# Altium project CAR_Interface.PrjPcb
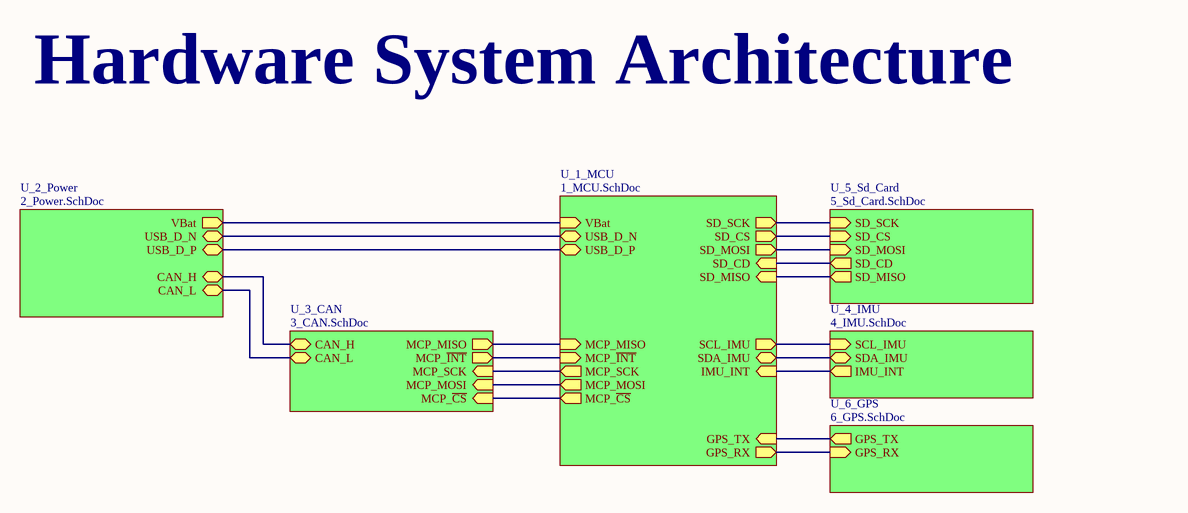
[diagram p0: 0_Overview.SchDoc]
6 sheets, 65 parts. Net scope: hierarchical (ports join the sheet entries above them; power ports are global).
Board file: CAR_Interface_PCB.PcbDoc
Sheets:
  0_Overview.SchDoc
    U_1_MCU = 1_MCU.SchDoc
    U_2_Power = 2_Power.SchDoc
    U_4_IMU = 4_IMU.SchDoc
    U_5_Sd_Card = 5_Sd_Card.SchDoc
    U_6_GPS = 6_GPS.SchDoc

## Sheet 0_Overview.SchDoc
size A4; SheetNumber: 1; SheetTotal: 7

### Sub-sheets
U_1_MCU = 1_MCU.SchDoc: USB_D_N (bidir), USB_D_P (bidir), MCP_SCK (out), MCP_MOSI (out), MCP_MISO (in), MCP_~{INT} (in), MCP_~{CS} (out), SD_SCK (out), SD_CS (out), SD_MOSI (out), SD_MISO (in), GPS_TX (in), GPS_RX (out), SCL_IMU (out), SDA_IMU (bidir), IMU_INT (in), VBat (in), SD_CD (in)
U_2_Power = 2_Power.SchDoc: CAN_L (bidir), CAN_H (bidir), USB_D_P (bidir), USB_D_N (bidir), VBat (out)
U_3_CAN = 3_CAN.SchDoc (file not in this document): CAN_H (bidir), CAN_L (bidir), MCP_SCK (in), MCP_MOSI (in), MCP_MISO (out), MCP_~{INT} (out), MCP_~{CS} (in)
U_4_IMU = 4_IMU.SchDoc: SCL_IMU (in), SDA_IMU (bidir), IMU_INT (out)
U_5_Sd_Card = 5_Sd_Card.SchDoc: SD_SCK (in), SD_CS (in), SD_MOSI (in), SD_MISO (out), SD_CD (out)
U_6_GPS = 6_GPS.SchDoc: GPS_TX (out), GPS_RX (in)

### Nets
CAN_H: sheet U_2_Power/CAN_H, sheet U_3_CAN/CAN_H
CAN_L: sheet U_2_Power/CAN_L, sheet U_3_CAN/CAN_L
GPS_RX: sheet U_1_MCU/GPS_RX, sheet U_6_GPS/GPS_RX
GPS_TX: sheet U_1_MCU/GPS_TX, sheet U_6_GPS/GPS_TX
IMU_INT: sheet U_1_MCU/IMU_INT, sheet U_4_IMU/IMU_INT
SCL_IMU: sheet U_1_MCU/SCL_IMU, sheet U_4_IMU/SCL_IMU
SD_CD: sheet U_1_MCU/SD_CD, sheet U_5_Sd_Card/SD_CD
SD_CS: sheet U_1_MCU/SD_CS, sheet U_5_Sd_Card/SD_CS
SD_MISO: sheet U_1_MCU/SD_MISO, sheet U_5_Sd_Card/SD_MISO
SD_MOSI: sheet U_1_MCU/SD_MOSI, sheet U_5_Sd_Card/SD_MOSI
SD_SCK: sheet U_1_MCU/SD_SCK, sheet U_5_Sd_Card/SD_SCK
SDA_IMU: sheet U_1_MCU/SDA_IMU, sheet U_4_IMU/SDA_IMU
USB_D_N: sheet U_1_MCU/USB_D_N, sheet U_2_Power/USB_D_N
USB_D_P: sheet U_1_MCU/USB_D_P, sheet U_2_Power/USB_D_P
VBat: sheet U_1_MCU/VBat, sheet U_2_Power/VBat
NetU100_18: sheet U_1_MCU/MCP_~{CS}, sheet U_3_CAN/MCP_~{CS}
NetU100_19: sheet U_1_MCU/MCP_MOSI, sheet U_3_CAN/MCP_MOSI
NetU100_20: sheet U_1_MCU/MCP_SCK, sheet U_3_CAN/MCP_SCK
NetU100_21: sheet U_1_MCU/MCP_MISO, sheet U_3_CAN/MCP_MISO
NetU100_22: sheet U_1_MCU/MCP_~{INT}, sheet U_3_CAN/MCP_~{INT}

### Notes on the sheet
- Hardware System Architecture

## Sheet 1_MCU.SchDoc
size A4; SheetNumber: 2; SheetTotal: 7
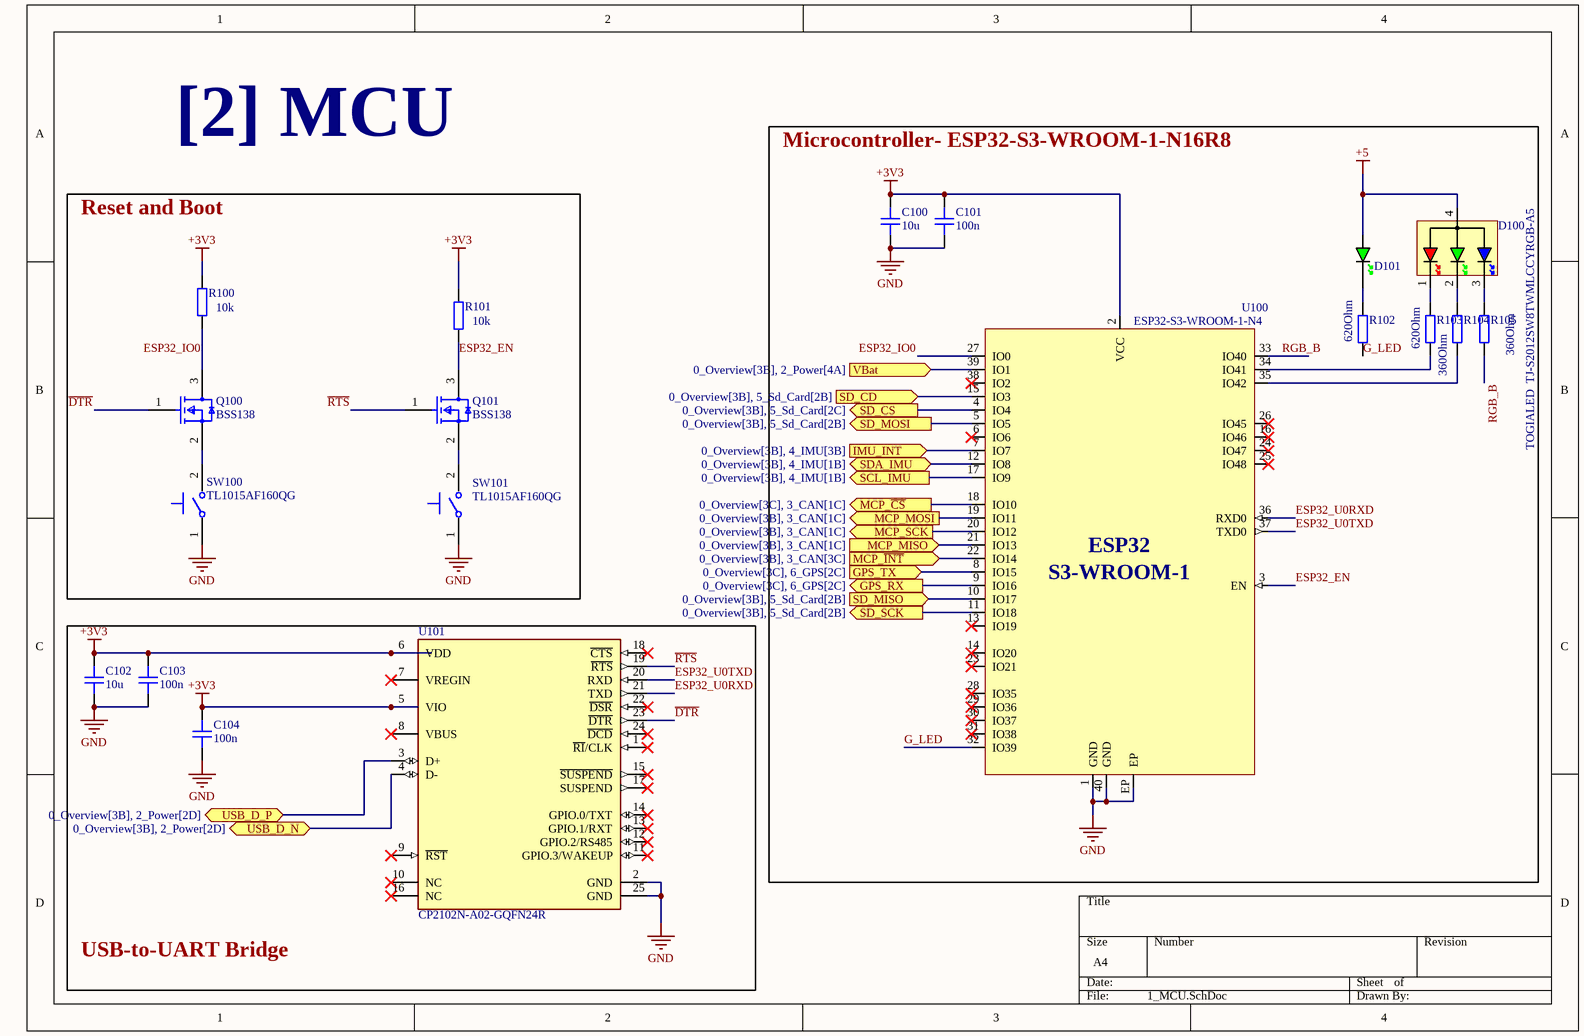
[diagram p1: 1_MCU.SchDoc]

### Parts
C100  10u  [CAP_0805]
C101  100n  [CAP_0603]
C102  10u  [CAP_0805]
C103  100n  [CAP_0603]
C104  100n  [CAP_0603]
D100  TOGIALED  TJ-S2012SW8TWMLCCYRGB-A5  [150080M153000]
D101  GREEN  [LED_0603_GREEN]  (value not drawn)
Q100  BSS138  [FP-318-08-IPC_B]
Q101  BSS138  [FP-318-08-IPC_B]
R100  10k  [RES_0603]
R101  10k  [RES_0603]
R102  620Ohm  [RES_0603]
R103  620Ohm  [RES_0603]
R104  360Ohm  [RES_0603]
R105  360Ohm  [RES_0603]
SW100  TL1015AF160QG  [FP-TL1015AF160QG-MFG]
SW101  TL1015AF160QG  [FP-TL1015AF160QG-MFG]
U100  ESP32-S3-WROOM-1-N4  [ESP32-S3-WROOM-1]
U101  CP2102N-A02-GQFN24R  [FP-CP2102N-A02-GQFN24R-MFG]

### Blocks framed on the sheet
Microcontroller- ESP32‑S3‑WROOM‑1‑N16R8: C100 C101 D100 D101 R102-R105 U100
Reset and Boot: Q100 Q101 R100 R101 SW100 SW101
USB‑to‑UART Bridge: C102-C104 U101

### Ports
GPS_RX (out, see 0_Overview[3C], 6_GPS[2C]), GPS_TX (in, see 0_Overview[3C], 6_GPS[2C]), IMU_INT (in, see 0_Overview[3B], 4_IMU[3B]), MCP_MISO (in, see 0_Overview[3B], 3_CAN[1C]), MCP_MOSI (out, see 0_Overview[3B], 3_CAN[1C]), MCP_SCK (out, see 0_Overview[3B], 3_CAN[1C]), MCP_~{CS} (out, see 0_Overview[3C], 3_CAN[1C]), MCP_~{INT} (in, see 0_Overview[3B], 3_CAN[3C]), SCL_IMU (out, see 0_Overview[3B], 4_IMU[1B]), SD_CD (in, see 0_Overview[3B], 5_Sd_Card[2B]), SD_CS (out, see 0_Overview[3B], 5_Sd_Card[2C]), SD_MISO (in, see 0_Overview[3B], 5_Sd_Card[2B]), SD_MOSI (out, see 0_Overview[3B], 5_Sd_Card[2B]), SD_SCK (out, see 0_Overview[3B], 5_Sd_Card[2B]), SDA_IMU (bidir, see 0_Overview[3B], 4_IMU[1B]), USB_D_N (bidir, see 0_Overview[3B], 2_Power[2D]), USB_D_P (bidir, see 0_Overview[3B], 2_Power[2D]), VBat (in, see 0_Overview[3B], 2_Power[4A])

### Nets
+3V3: C100.2 C101.1 C102.2 C103.1 C104.1 R100.2 R101.2 U100.2(VCC) U101.5(VIO) U101.6(VDD)
+5: D100.4(AC) D101.A
GND: C100.1 C101.2 C102.1 C103.2 C104.2 SW100.1 SW101.1 U100.1(GND) U100.40(GND) U100.EP U101.2(GND) U101.25(GND)
~{DTR}: Q100.1(G) U101.23(~{DTR})
ESP32_EN: Q101.3(D) R101.1 U100.3(EN)
ESP32_IO0: Q100.3(D) R100.1 U100.27(IO0)
ESP32_U0RXD: U100.36(RXD0) U101.21(TXD)
ESP32_U0TXD: U100.37(TXD0) U101.20(RXD)
G_LED: R102.1 U100.32(IO39)
GPS_RX: U100.9(IO16) ; port GPS_RX
GPS_TX: U100.8(IO15) ; port GPS_TX
IMU_INT: U100.7(IO7) ; port IMU_INT
~{RTS}: Q101.1(G) U101.19(~{RTS})
RGB_B: R105.1 U100.33(IO40)
SCL_IMU: U100.17(IO9) ; port SCL_IMU
SD_CD: U100.15(IO3) ; port SD_CD
SD_CS: U100.4(IO4) ; port SD_CS
SD_MISO: U100.10(IO17) ; port SD_MISO
SD_MOSI: U100.5(IO5) ; port SD_MOSI
SD_SCK: U100.11(IO18) ; port SD_SCK
SDA_IMU: U100.12(IO8) ; port SDA_IMU
USB_D_N: U101.4(D-) ; port USB_D_N
USB_D_P: U101.3(D+) ; port USB_D_P
VBat: U100.39(IO1) ; port VBat
NetD100_1: D100.1(CR) R103.2
NetD100_2: D100.2(CG) R104.2
NetD100_3: D100.3(CB) R105.2
NetD101_K: D101.K R102.2
NetQ100_2: Q100.2(S) SW100.2
NetQ101_2: Q101.2(S) SW101.2
NetR103_1: R103.1 U100.34(IO41)
NetR104_1: R104.1 U100.35(IO42)
NetU100_18: U100.18(IO10) ; port MCP_~{CS}
NetU100_19: U100.19(IO11) ; port MCP_MOSI
NetU100_20: U100.20(IO12) ; port MCP_SCK
NetU100_21: U100.21(IO13) ; port MCP_MISO
NetU100_22: U100.22(IO14) ; port MCP_~{INT}

Not connected (* = marked no-connect by the designer): U100 6(IO6)* 13(IO19)* 14(IO20)* 16(IO46)* 23(IO21)* 24(IO47)* 25(IO48)* 26(IO45)* 28(IO35)* 29(IO36)* 30(IO37)* 31(IO38)* 38(IO2)*; U101 1(~{RI}/CLK)* 7(VREGIN)* 8(VBUS)* 9(~{RST})* 10(NC)* 11(GPIO.3/WAKEUP)* 12(GPIO.2/RS485)* 13(GPIO.1/RXT)* 14(GPIO.0/TXT)* 15(~{SUSPEND})* 16(NC)* 17(SUSPEND)* 18(~{CTS})* 22(~{DSR})* 24(~{DCD})*

### Notes on the sheet
- [2] MCU
- (in symbol ESP32-S3-WROOM-1-N4) ESP32; S3-WROOM-1

### Library data of the parts
C100 C102 = CAP_0805: Capacitor SMD 0805; Manufacturer: *; Manufacturer Part Number: *; Distributor Link: *; LCSC: *; Rating: *; Dielectric: *
C101 C103 C104 = CAP_0603: Capacitor SMD 0603; Manufacturer: *; Manufacturer Part Number: *; Distributor Link: *; LCSC: *; Rating: *; Dielectric: *
D100 = 150080M153000: RGB LED Common Anode SMD Diffused 0805 Top View; Manufacturer: Wurth; Manufacturer Part Number: 150080M153000; Distributor Link: https://www.mouser.de/ProductDetail/Wurth-Elektronik/150080M153000?qs=5aG0NVq1C4wI5cZ2wabu5A%3D%3D
D101 = LED_0603_GREEN: LED 0603 GREEN SMD
Q100 Q101 = CMP-07173-000101-1: MOSFET N-CH 50V 220MA SOT-23; Turn-Off Delay Time: 20ns; Element Configuration: Single; Rds On Max: 3.5R; Gate to Source Voltage (Vgs): 20V; Threshold Voltage: 1.3V; Number of Elements: 1; Power Dissipation: 360mW; Rise Time: 9ns; Turn-On Delay Time: 2.5ns; Input Capacitance: 27pF; On-State Resistance: 6R; Lead Free: Lead Free; Length: 2.92mm; Width: 1.3mm; Drain to Source Breakdown Voltage: 50V; Min Operating Temperature: -55°C; REACH SVHC: No SVHC; Packaging: Tape and Reel; Radiation Hardening: No; Height: 0.93mm; Drain to Source Voltage (Vdss): 50V; Current Rating: 220mA; Voltage Rating (DC): 50V; Weight: 0.03g; Continuous Drain Current (ID): 220mA; Number of Pins: 3; Nominal Vgs: 1.3V; Max Power Dissipation: 360mW; Fall Time: 9ns; Drain to Source Resistance: 3.5R; Contact Plating: Tin; Case/Package: SOT-23; Package Quantity: 1; Dual Supply Voltage: 50V; Mount: Surface Mount; Termination: SMD/SMT; Max Operating Temperature: 150°C
R100-R105 = RES_0603: Resistor SMD 0603; Manufacturer: *; Manufacturer Part Number: *; Distributor Link: *; LCSC: *
SW100 SW101 = CMP-17879-000003-1: SWITCH TACTILE SPST-NO 0.05A 12V; Actuator Type: Standard; Actuator Length: 0.5mm; Contact Current Rating: 50mA; Mechanical Life: 200000Cycles; Switch Function: Off-Mom; Switch Travel: 0.2mm; Illumination Type: Non-Illuminated; Operating Force: 160gf; Actuator Material: Nylon; Electrical Life: 50000Cycles; Throw Configuration: SPST; Contact Resistance: 100mR; Orientation: Straight; Max Voltage Rating (DC): 12V; Max Operating Temperature: 70°C; Package Quantity: 1; Contact Material: Silver; Packaging: Tape and Reel; Mount: Surface Mount; Color: Beige; Termination: Gull Wing; Case/Package: SMD/SMT; Voltage Rating (DC): 12V; Contact Plating: Silver; REACH SVHC: No SVHC; Min Operating Temperature: -20°C; Current Rating: 50mA; Lead Free: Lead Free
U100 = ESP32-S3-WROOM-1-N4: 2.4 GHz Wi-Fi (802.11 b/g/n) and Bluetooth 5 (LE) Module ESP32-S3, 4MB Flash, on-board PCB antenna); Manufacturer: Espressif; Manufacturer Part Number: ESP32-S3-WROOM-1-N4; Distributor Link: https://www.mouser.de/ProductDetail/Espressif-Systems/ESP32-S3-WROOM-1-N4?qs=Li%252BoUPsLEnsO%2FkiJOUK0FQ%3D%3D
U101 = CMP-08107-000009-2: IC USB TO UART BRIDGE QFN24; Manufacturer Lifecycle Status: FULL PRODUCTION; NexarPartId: 99772192; Max Junction Temperature (Tj): 105°C; Min Supply Voltage: 1.71V; Max Supply Voltage: 3.6V; Number of Digital IO: 4; Interface: I2C, RS-485, UART, USB; Lifecycle Status: Production; Min Operating Temperature: -40°C; Height: 800µm; Ambient Temperature Range High: 85°C; Schedule B: 8542390000, 8542390000; Max Operating Temperature: 85°C

## Sheet 2_Power.SchDoc
size A4; SheetNumber: 4; SheetTotal: 7
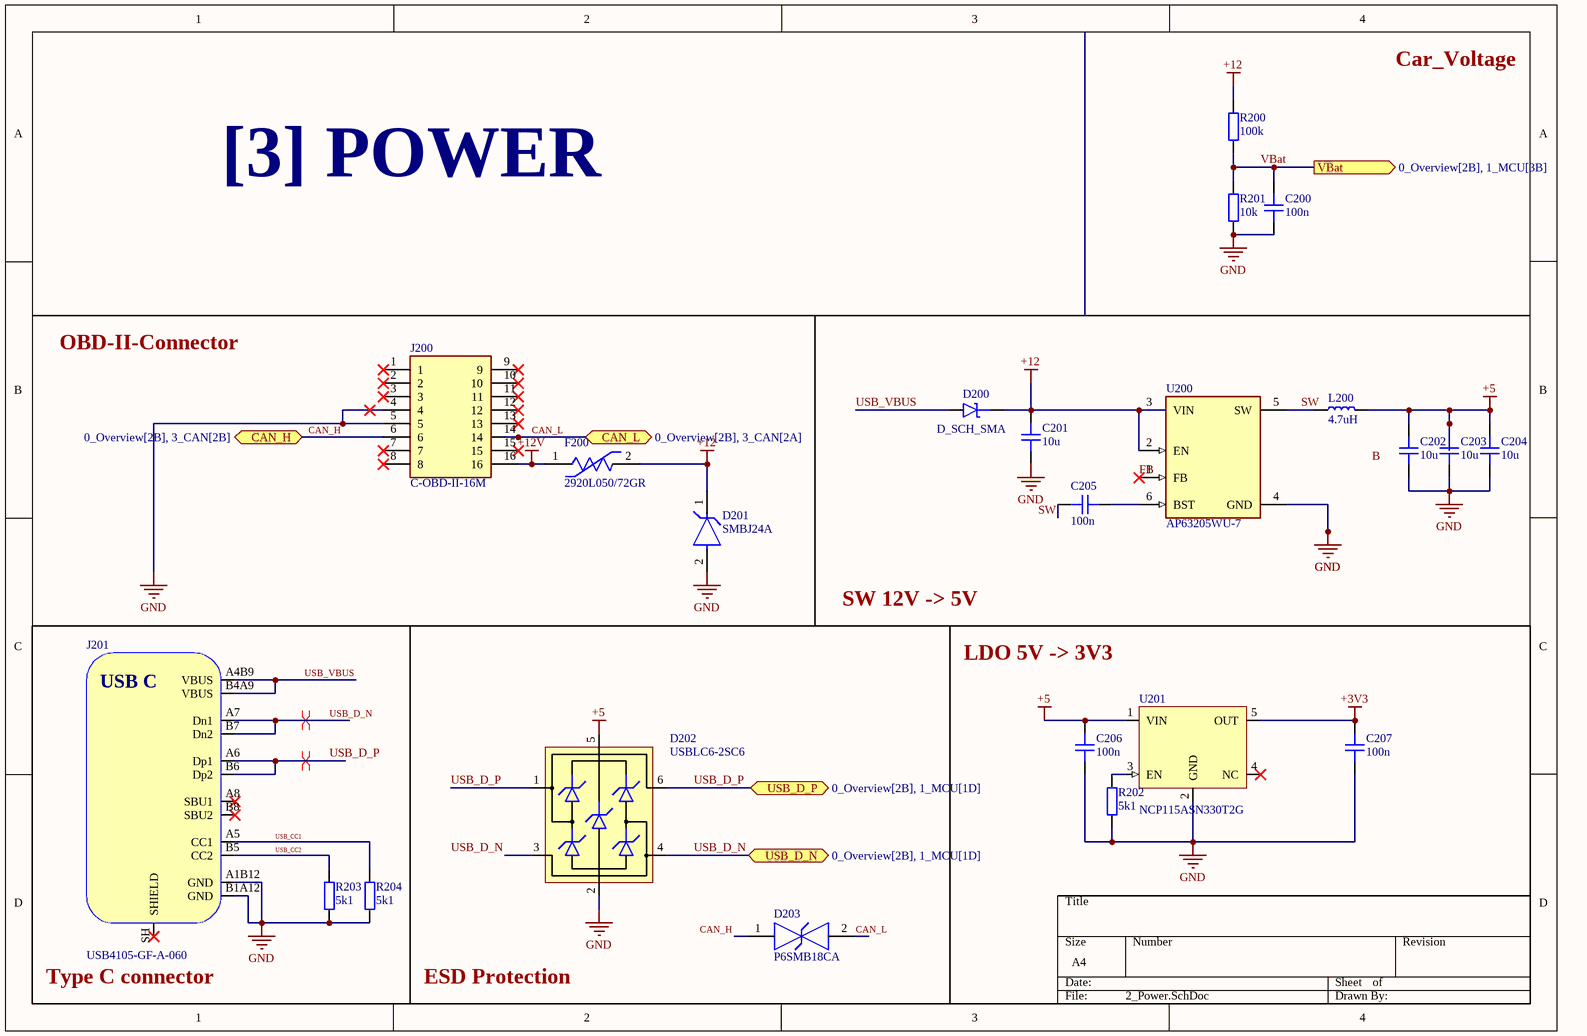
[diagram p2: 2_Power.SchDoc]

### Parts
C200  100n  [CAP_0805]
C201  10u  [CAP_0805]
C202  10u  [CAP_0805]
C203  10u  [CAP_0805]
C204  10u  [CAP_0805]
C205  100n  [CAP_0603]
C206  100n  [CAP_0603]
C207  100n  [CAP_0603]
D200  D_SCH_SMA  [DO-214AC-2 (SMA)]
D201  SMBJ24A  [FP-SMBJ-MFG]
D202  USBLC6-2SC6  [SOT-23-6]
D203  P6SMB18CA  [FP-P6SMB-CA-MFG]
F200  2920L050/72GR  [FP-2920L-MFG]
J200  C-OBD-II-16M  [COMTECH_C-OBD-II-16M]
J201  USB4105-GF-A-060  [USB4105-GF-A-060]
L200  4.7uH  [ASPI-4030S]
R200  100k  [RES_0805]
R201  10k  [RES_0805]
R202  5k1  [RES_0603]
R203  5k1  [RES_0603]
R204  5k1  [RES_0603]
U200  AP63205WU-7  [FP-TSOT26-MFG]
U201  NCP115ASN330T2G  [TSOT25]

### Ports
CAN_H (bidir, see 0_Overview[2B], 3_CAN[2B]), CAN_L (bidir, see 0_Overview[2B], 3_CAN[2A]), USB_D_N (bidir, see 0_Overview[2B], 1_MCU[1D]), USB_D_P (bidir, see 0_Overview[2B], 1_MCU[1D]), VBat (out, see 0_Overview[2B], 1_MCU[3B])

### Nets
+3V3: C207.1 U201.5(OUT)
+5: C202.2 C203.2 C204.2 C206.1 D202.5(VBUS) L200.2 U201.1(VIN)
+12: C201.2 D200.K D201.1(C) F200.2 R200.2 U200.2(EN) U200.3(VIN)
+12V: F200.1 J200.16
GND: C200.1 C201.1 C202.1 C203.1 C204.1 C206.2 C207.2 D201.2(A) D202.2(GND) J200.4 J200.5 J201.A1B12(GND) J201.B1A12(GND) R201.1 R202.1 R203.1 R204.1 U200.4(GND) U201.2(GND)
CAN_H: D203.1 J200.6 ; port CAN_H
CAN_L: D203.2 J200.14 ; port CAN_L
FB: U200.1(FB)
SW: C205.2 L200.1 U200.5(SW)
USB_CC1: J201.A5(CC1) R204.2
USB_CC2: J201.B5(CC2) R203.2
USB_D_N: D202.3(IO2) D202.4(IO2) J201.A7(Dn1) J201.B7(Dn2) ; port USB_D_N
USB_D_P: D202.1(IO1) D202.6(IO1) J201.A6(Dp1) J201.B6(Dp2) ; port USB_D_P
USB_VBUS: D200.A J201.A4B9(VBUS) J201.B4A9(VBUS)
VBat: C200.2 R200.1 R201.2 ; port VBat
NetC205_1: C205.1 U200.6(BST)
NetR202_2: R202.2 U201.3(EN)

Not connected (* = marked no-connect by the designer): J200 1* 2* 3* 7* 8* 9* 10* 11* 12* 13* 15*; J201 A8(SBU1)* B8(SBU2)* SH(SHIELD)*; U201 4(NC)*

### Layout directives
differential pair; differential pair class USB_D: USB_D_N, USB_D_P

### Notes on the sheet
- Car_Voltage
- [3] POWER
- OBD-II-Connector
- SW 12V -> 5V
- LDO 5V -> 3V3
- (near J201) Type C connector
- ESD Protection
- Labels drawn without touching a wire or pin: B
- (in symbol USB4105-GF-A-060) USB C

### Library data of the parts
C200-C204 = CAP_0805: Capacitor SMD 0805; Manufacturer: *; Manufacturer Part Number: *; Distributor Link: *; LCSC: *; Rating: *; Dielectric: *
C205-C207 = CAP_0603: Capacitor SMD 0603; Manufacturer: *; Manufacturer Part Number: *; Distributor Link: *; LCSC: *; Rating: *; Dielectric: *
D200 = D_SCHOTTKY_SMA: Diode Schottky SMD SMA (DO-214AA)
D201 = CMP-07401-000035-1: TVS DIODE 24V 38.9V SMB; Max Breakdown Voltage: 30.7V; Operating Supply Voltage: 3.5V; Min Breakdown Voltage: 26.7V; Test Current: 1mA; Direction: Unidirectional; Peak Pulse Current: 15.4A; Peak Pulse Power: 600W; Number of Unidirectional Channels: 1; Element Configuration: Single; Power Line Protection: No; Diode Type: ZENER; Leakage Current: 5uA; Max Surge Current: 100A; ESD Protection: Yes; Width: 3.94mm; Number of Pins: 2; Clamping Voltage: 38.9V; Reverse Standoff Voltage: 24V; Breakdown Voltage: 30.7V; RoHS Compliant: Yes; Package Quantity: 1; Case/Package: SMB; Mount: Surface Mount; Resistor Type: Zener; Packaging: Tape and Reel; Reverse Breakdown Voltage: 26.7V; Series: SMBJ; Radiation Hardening: No; Max Operating Temperature: 150°C; Termination: SMD/SMT; Number of Channels: 1; Length: 4.57mm; REACH SVHC: No SVHC; Number of Elements: 1; Polarity: Unidirectional; Height: 2.42mm; Max Power Dissipation: 600W; Max Reverse Leakage Current: 5uA; Min Operating Temperature: -55°C
D202 = USBLC6-2SC6: Low-Capacitance ESD Protection USB; Manufacturer: STMicroelectronics; Manufacturer Part Number: USBLC6-2SC6; Distributor Link: https://www.mouser.de/ProductDetail/STMicroelectronics/USBLC6-2SC6?qs=po45yt2pPpu%2FhNIlwQdTlg%3D%3D
D203 = CMP-08607-000095-1: TVS DIODE 15.3V 25.5V DO214AA; Min Breakdown Voltage: 17.1V; Peak Pulse Current: 24.2A; Power Line Protection: No; Max Surge Current: 24A; Polarity: Bidirectional; Power Dissipation: 600W; Number of Bidirectional Channels: 1; Max Breakdown Voltage: 18.9V; Test Current: 1mA; Max Power Dissipation: 5W; Leakage Current: 1uA; Operating Supply Voltage: 15.3V; Min Operating Temperature: -55°C; Mount: Surface Mount; Package Quantity: 3000; Lead Free: Lead Free; Reverse Standoff Voltage: 15.3V; Breakdown Voltage: 17.1V; Composition: Zener; Max Operating Temperature: 150°C; Number of Channels: 1; Termination: SMD/SMT; Case/Package: SMB; Packaging: Tape and Reel; Reverse Breakdown Voltage: 17.1V; Peak Pulse Power: 600W; Number of Elements: 1; Clamping Voltage: 25.5V; Direction: Bidirectional; Number of Pins: 2
F200 = CMP-08606-000028-1: PTC RESET FUSE 60V 1.1A 2920; Manufacturer Part Number: 2920L110/60MR; Manufacturer: Littelfuse; Value: 0.12-0.41Ω; Trip Time: 0.5s; Current Rating: 20A; Trip Current: 2.2A; Category: Fuse; Temperature: -40°C to +85°C; ComponentLink2Description: Datasheet; Lead Free: Yes; Temperature Range Low: -40°C; ComponentLink2URL: https://m.littelfuse.com/~/media/electronics/datasheets/resettable_ptcs/littelfuse_ptc_2920l_datasheet.pdf.pdf; Height: 2mm; Temperature Range High: +85°C; Automotive: No; Digikey Description: PTC RESET FUSE 60V 1.1A 2920; Device Class L3: unset; RoHS: TRUE; Device Class L2: PTC Resettable Fuses; Voltage Rating: 60V; Octopart: https://octopart.com/2920l110%2F60mr-littelfuse-75250824; Device Class L1: Circuit Protection; Package: 2920L; Hold Current: 1.1A; Ambient Temperature Range High: +85°C; Resistance: 0.12-0.41Ω; Ambient Temperature Range Low: -40°C
J200 = CMP-002-00074-1: OBD II 16pin 90 Degree Angle Male Plug Connector; MF: Comtech Electronic Co., LTD; Value: *; Design Item ID: C-OBD-II-16M; Case/Package: None; Check_prices: https://www.snapeda.com/parts/C-OBD-II-16M/Comtech+Electronic+Co.%252C+LTD/view-part/?ref=eda; Component Type: Standard; Source: C-OBD-II-16M.SchLib; Pins: 16; SnapEDA_Link: https://www.snapeda.com/parts/C-OBD-II-16M/Comtech+Electronic+Co.%252C+LTD/view-part/?ref=snap; MP: C-OBD-II-16M
J201 = USB4105-GF-A-060: USB Connector Type C SMT 12 Pin; Manufacturer: GCT; Manufacturer Part Number: USB4105-GF-A-060; Distributor Link: https://eu.mouser.com/ProductDetail/GCT/USB4105-GF-A-060?qs=QNEnbhJQKvY2mocwNJzgfA%3D%3D
L200 = ASPI-4030S: Power Inductor SMD ASPI-4030S Series; Manufacturer: ABRACON; Manufacturer Part Number: ASPI-4030S*; Distirbutor Link: *
R200 R201 = RES_0805: Resistor SMD 0805; Manufacturer: *; Manufacturer Part Number: *; Distributor Link: *; LCSC: *
R202-R204 = RES_0603: Resistor SMD 0603; Manufacturer: *; Manufacturer Part Number: *; Distributor Link: *; LCSC: *
U200 = CMP-12757-000001-1: IC REG BUCK 5V 2A TSOT26; Manufacturer: Diodes Inc.; Max Junction Temp: +160°C; Max Duty Cycle: 100%; Standoff Height: 0.01mm; Max Supply Voltage: 32V; Number Of Outputs: 1; Min Supply Voltage: 3.8V; Output Type: Fixed; Switching Frequency: 1100kHz; Nominal Supply Current: 22uA; Automotive: No; RoHS: TRUE; Switching Topology: Buck; Temperature: -40°C to +85°C; Footprint Url: https://www.diodes.com/assets/Package-Files/TSOT26.pdf; Lead Free: Yes; Digikey Description: IC REG BUCK 5V 2A TSOT26; Device Class L3: Voltage Regulators - Switching; Ambient Temperature Range High: +85°C; Category: IC; Package: TSOT26; Output Voltage: 5V; Output Current: 2A; ComponentLink2Description: Datasheet; Device Class L2: Power Management ICs; Ambient Temperature Range Low: -40°C; Temperature Range High: +85°C; Temperature Range Low: -40°C; Octopart: https://octopart.com/ap63205wu-7-diodes+inc.-98099551; Manufacturer Part Number: AP63205WU-7; Height: 1mm; Device Class L1: Integrated Circuits (ICs); ComponentLink2URL: https://www.diodes.com/assets/Datasheets/AP63200-AP63201-AP63203-AP63205.pdf
U201 = NCP115ASN330T2G: LDO Regulator - High PSRR 300 mA 3.3V TSOP-5; Manufacturer: ON Semiconductor; Manufacturer Part Number: NCP115ASN330T2G

## Sheet 4_IMU.SchDoc
size A4; SheetNumber: 6; SheetTotal: 7
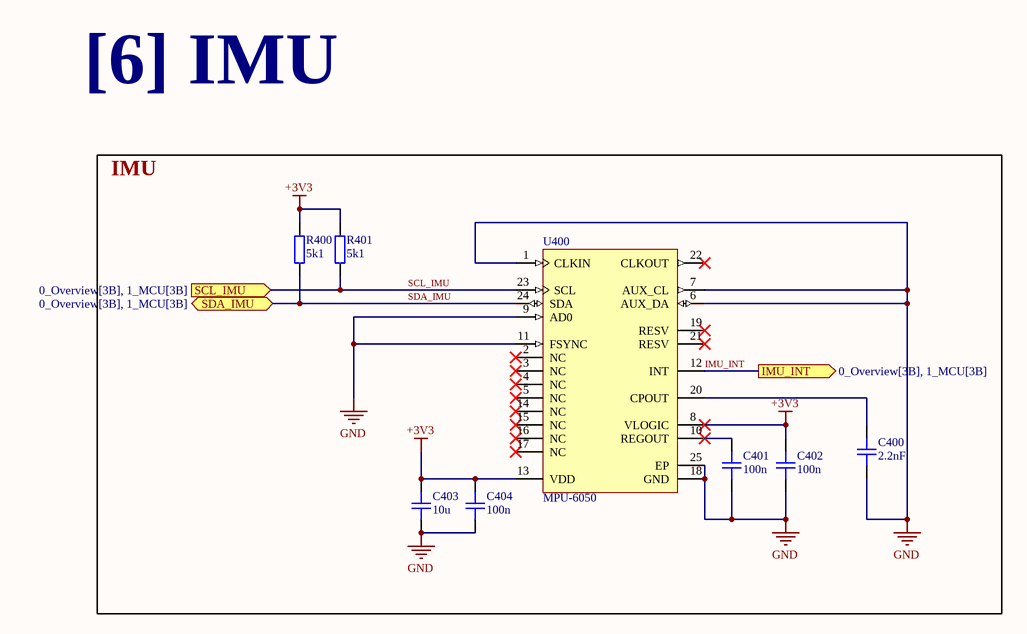
[diagram p3: 4_IMU.SchDoc]

### Parts
C400  2.2nF  [CAP_0603]
C401  100n  [CAP_0603]
C402  100n  [CAP_0603]
C403  10u  [CAP_0805]
C404  100n  [CAP_0603]
R400  5k1  [RES_0603]
R401  5k1  [RES_0603]
U400  MPU-6050  [IS-QFN-24_V]

### Blocks framed on the sheet
IMU: C400-C404 R400 R401 U400

### Ports
IMU_INT (out, see 0_Overview[3B], 1_MCU[3B]), SCL_IMU (in, see 0_Overview[3B], 1_MCU[3B]), SDA_IMU (bidir, see 0_Overview[3B], 1_MCU[3B])

### Nets
+3V3: C402.1 C403.2 C404.1 R400.2 R401.2 U400.8(VLOGIC) U400.13(VDD)
GND: C400.2 C401.2 C402.2 C403.1 C404.2 U400.1(CLKIN) U400.6(AUX_DA) U400.7(AUX_CL) U400.9(AD0) U400.11(FSYNC) U400.18(GND) U400.25(EP)
IMU_INT: U400.12(INT) ; port IMU_INT
SCL_IMU: R401.1 U400.23(SCL) ; port SCL_IMU
SDA_IMU: R400.1 U400.24(SDA) ; port SDA_IMU
NetC400_1: C400.1 U400.20(CPOUT)
NetC401_1: C401.1 U400.10(REGOUT)

Not connected (* = marked no-connect by the designer): U400 2(NC)* 3(NC)* 4(NC)* 5(NC)* 14(NC)* 15(NC)* 16(NC)* 17(NC)* 19(RESV)* 21(RESV)* 22(CLKOUT)*

### Notes on the sheet
- [6] IMU

### Library data of the parts
C400-C402 C404 = CAP_0603: Capacitor SMD 0603; Manufacturer: *; Manufacturer Part Number: *; Distributor Link: *; LCSC: *; Rating: *; Dielectric: *
C403 = CAP_0805: Capacitor SMD 0805; Manufacturer: *; Manufacturer Part Number: *; Distributor Link: *; LCSC: *; Rating: *; Dielectric: *
R400 R401 = RES_0603: Resistor SMD 0603; Manufacturer: *; Manufacturer Part Number: *; Distributor Link: *; LCSC: *
U400 = CMP-1753-00002-2: 3-Axis Gyroscope, Accelerometer and a Digital Motion Processor(TM) (DMP), 2.375 to 3.46 V, -40 to 85 degC, 24-Pin QFN, RoHS, Tape and Reel; Manufacturer: InvenSense; Featured Product: MPU-60506-Axis,IntegratedI²CSolution; Other Names: 1428-1007-2 / MPU6050; Sensor Type: MotionTracking; Online Catalog: MPU-6000™Series; Unit PriceUSD: Digital; Datasheet Version: Rev. 3.3, 05/2012; Category: Sensors,Transducers; Datasheet URL: http://datasheet.octopart.com/MPU-6050-InvenSense-datasheet-14421344.pdf; Family: Multifunction; Standard Package: 5,000; Manufacturer URL: http://www.invensense.com/; Output Type: Digital; Dynamic Catalog: MPU-6000™Series

## Sheet 5_Sd_Card.SchDoc
size A4; SheetNumber: 6; SheetTotal: 7
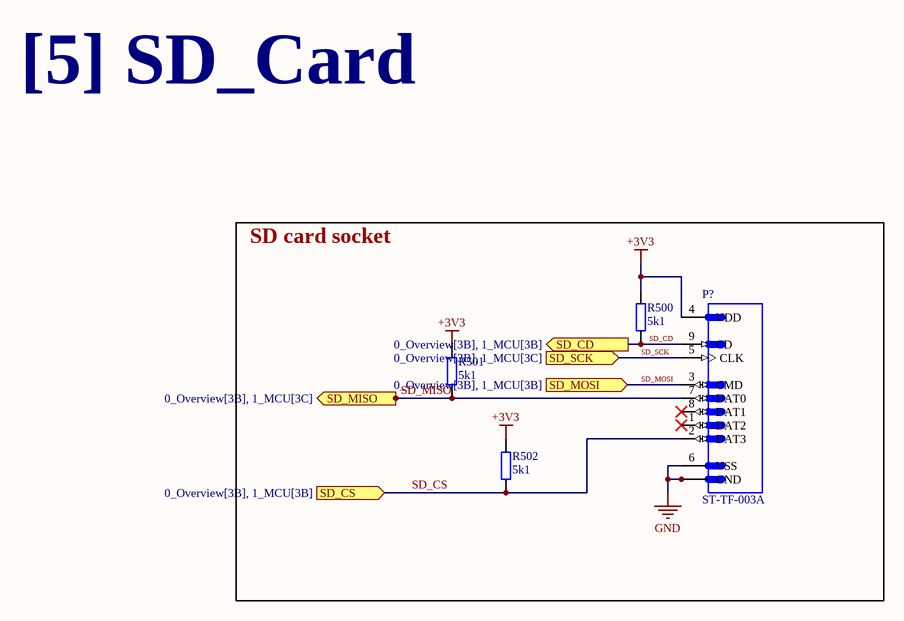
[diagram p4: 5_Sd_Card.SchDoc]

### Parts
P?  ST-TF-003A  [SUNTECH_ST-TF-003A]
R500  5k1  [RES_0603]
R501  5k1  [RES_0603]
R502  5k1  [RES_0603]

### Blocks framed on the sheet
SD card socket: P? R500-R502

### Ports
SD_CD (out, see 0_Overview[3B], 1_MCU[3B]), SD_CS (in, see 0_Overview[3B], 1_MCU[3B]), SD_MISO (out, see 0_Overview[3B], 1_MCU[3C]), SD_MOSI (in, see 0_Overview[3B], 1_MCU[3B]), SD_SCK (in, see 0_Overview[3B], 1_MCU[3C])

### Nets
+3V3: P?.4(VDD) R500.2 R501.2 R502.2
GND: P?.6(VSS) P?.G1(GND) P?.G2(GND) P?.G3(GND) P?.G4(GND)
SD_CD: P?.9(CD) R500.1 ; port SD_CD
SD_CS: P?.2(DAT3) R502.1 ; port SD_CS
SD_MISO: P?.7(DAT0) R501.1 ; port SD_MISO
SD_MOSI: P?.3(CMD) ; port SD_MOSI
SD_SCK: P?.5(CLK) ; port SD_SCK

Not connected (* = marked no-connect by the designer): P? 1(DAT2)* 8(DAT1)*

### Notes on the sheet
- [5] SD_Card

### Library data of the parts
P? = CMP-002-00072-2: Micro SD Card Socket; Case/Package: None; Source: ST-TF-003A.SchLib; Component Type: Standard; Availability: Unavailable; MP: ST-TF-003A; Value: *; Price: None; Design Item ID: ST-TF-003A; Pins: 13
R500-R502 = RES_0603: Resistor SMD 0603; Manufacturer: *; Manufacturer Part Number: *; Distributor Link: *; LCSC: *

## Sheet 6_GPS.SchDoc
size A4; SheetNumber: 3; SheetTotal: 7
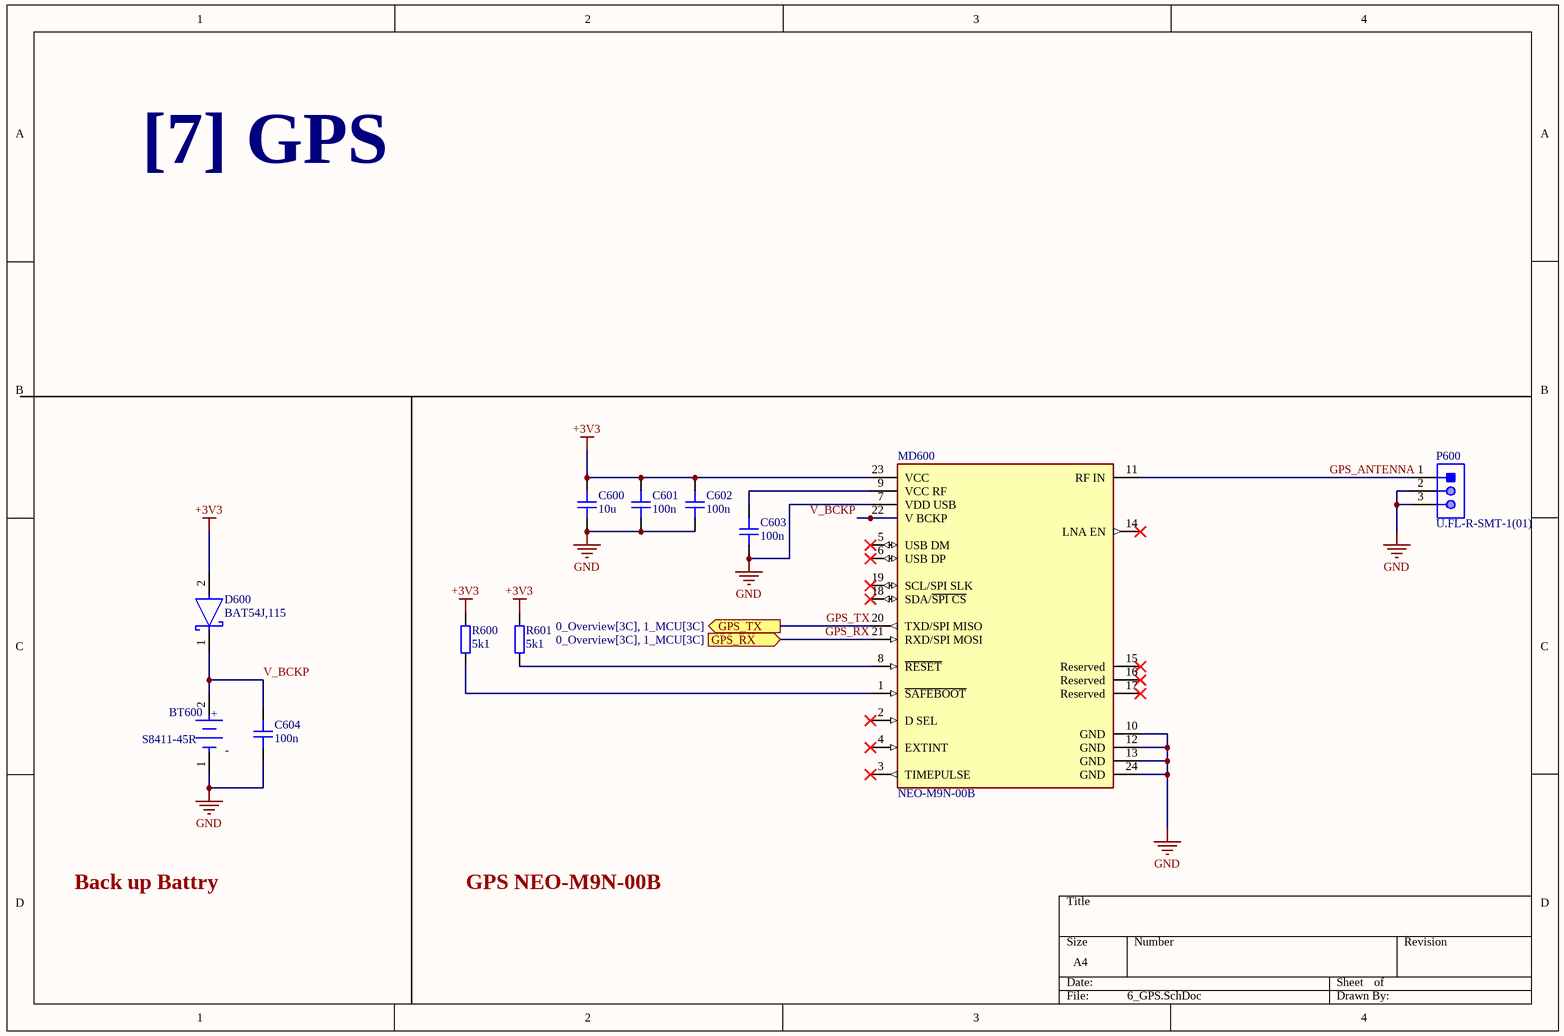
[diagram p5: 6_GPS.SchDoc]

### Parts
BT600  S8411-45R  [FP-S8411-45R-MFG]
C600  10u  [CAP_0805]
C601  100n  [CAP_0603]
C602  100n  [CAP_0603]
C603  100n  [CAP_0603]
C604  100n  [CAP_0603]
D600  BAT54J,115  [FP-SOD323F-MFG]
MD600  NEO-M9N-00B  [FP-NEO-M9N-00B-MFG]
P600  U.FL-R-SMT-1(01)  [HRS-U.FL-R-SMT-3_V]
R600  5k1  [RES_0603]
R601  5k1  [RES_0603]

### Ports
GPS_RX (in, see 0_Overview[3C], 1_MCU[3C]), GPS_TX (out, see 0_Overview[3C], 1_MCU[3C])

### Nets
+3V3: C600.2 C601.1 C602.1 D600.2(A) MD600.23(VCC) R600.2 R601.2
GND: BT600.1(C) C600.1 C601.2 C602.2 C603.2 C604.2 MD600.7(VDD_USB) MD600.10(GND) MD600.12(GND) MD600.13(GND) MD600.24(GND) P600.2 P600.3
GPS_ANTENNA: MD600.11(RF_IN) P600.1
GPS_RX: MD600.21(RXD/SPI_MOSI) ; port GPS_RX
GPS_TX: MD600.20(TXD/SPI_MISO) ; port GPS_TX
V_BCKP: BT600.2(A) C604.1 D600.1(C) MD600.22(V_BCKP)
NetC603_1: C603.1 MD600.9(VCC_RF)
NetMD600_1: MD600.1(~{SAFEBOOT}) R600.1
NetMD600_8: MD600.8(~{RESET}) R601.1

Not connected (* = marked no-connect by the designer): MD600 2(D_SEL)* 3(TIMEPULSE)* 4(EXTINT)* 5(USB_DM)* 6(USB_DP)* 14(LNA_EN)* 15(Reserved)* 16(Reserved)* 17(Reserved)* 18(SDA/~{SPI_CS})* 19(SCL/SPI_SLK)*

### Notes on the sheet
- [7] GPS
- Back up Battry
- GPS NEO-M9N-00B
- (in symbol CMP-15817-000007-1) +; -

### Library data of the parts
BT600 = CMP-15817-000007-1: BATTERY HOLDER COIN 12MM SMD; Number of Batteries: 1; Material: Polyphenylene; Case/Package: SMD/SMT; Number of Cells: 1; Min Operating Temperature: -55°C; Termination: SMD/SMT; REACH SVHC: No SVHC; Contact Plating: Bronze; Package Quantity: 500; Max Operating Temperature: 105°C; Mount: Surface Mount; Packaging: Tape and Reel
C600 = CAP_0805: Capacitor SMD 0805; Manufacturer: *; Manufacturer Part Number: *; Distributor Link: *; LCSC: *; Rating: *; Dielectric: *
C601-C604 = CAP_0603: Capacitor SMD 0603; Manufacturer: *; Manufacturer Part Number: *; Distributor Link: *; LCSC: *; Rating: *; Dielectric: *
D600 = CMP-14398-000037-1: DIODE SCHOTTKY 30V 200MA SOD323F; RoHS Compliant: Yes
MD600 = CMP-207130-000006-2: M9 standard precision module; Manufacturer: u-blox; Min Supply Voltage: 1.65V; Sensitivity: -167dBm; Interface: I2C,SPI,UART,USB; Max Supply Voltage: 3.6V; Device Class L3: RF Receivers; Category: UNK; Temperature Range Low: -40°C; Temperature Range High: +85°C; ComponentLink2Description: Datasheet; Manufacturer Part Number: NEO-M9N-00B; ComponentLink2URL: https://www.u-blox.com/sites/default/files/NEO-M9N_DataSheet_%28UBX-19014285%29.pdf; Footprint Url: https://www.u-blox.com/sites/default/files/NEO-M9N_Integrationmanual_%28UBX-19014286%29.pdf; Height: 2.6mm; Automotive: No; RoHS: TRUE; Lead Free: Yes; Octopart: https://octopart.com/neo-m9n-00b-u-blox-107315722; Package: 0; Temperature: -40°C to +85°C; Device Class L1: Integrated Circuits (ICs); Device Class L2: RF Semiconductors and Devices
P600 = CMP-2000-05153-1: Ultra Small Coaxial Connector, 6 GHz, -40 to 90 degC, 3-Pin SMD, RoHS, Bulk; Manufacturer: Hirose Electric; Connector Style: U.FL; Impedance: 50Ohm; Dielectric Material: LiquidCrystalPolymer(LCP); Minimum Quantity: UltraMiniatureCoaxial; Online Catalog: U.FLSeries; Featured Product: HiroseU.FLSeries; Frequency - Max: 6GHz; Other Names: H122041 / U.FL-R-SMT-1(01)-ND; Contact Termination: Solder; Body Material: PhosphorBronze; Connector Type: Jack,MalePin; Body Finish: Silver; Center Contact Plating: Gold; Manufacturer URL: https://www.hirose.com; Family: CoaxialConnectors(RF); Fastening Type: Snap-On; Unit PriceUSD: U.FL; Series: U.FL; Package Reference: U.FL-R-SMT; Packaging: Bulk; Standard Package: 100; Mounting Type: SurfaceMount; Quantity Available: Bulk; Housing Color: Silver; Package Description: 3-Pin Surface Mount Device, Body 2.6 x 2.6 mm; Category: Connectors,Interconnects; Operating Temperature: -40degC~90degC; Center Contact Material: PhosphorBronze; Dynamic Catalog: U.FLSeries; Datasheet URL: https://datasheet.ciiva.com/26945/getdatasheetpartid-475239-26945414.pdf; Datasheet Version: Feb-09; Shield Termination: Solder
R600 R601 = RES_0603: Resistor SMD 0603; Manufacturer: *; Manufacturer Part Number: *; Distributor Link: *; LCSC: *

## Nets that join several sheets
+3V3: 1_MCU (10 pins), 2_Power (C207.1 U201.5), 4_IMU (7 pins), 5_Sd_Card (P?.4 R500.2 R501.2 R502.2), 6_GPS (7 pins)
+5: 1_MCU (D100.4 D101.A), 2_Power (7 pins)
GND: 1_MCU (12 pins), 2_Power (19 pins), 4_IMU (12 pins), 5_Sd_Card (5 pins), 6_GPS (13 pins)
GPS_RX: 1_MCU (U100.9), 6_GPS (MD600.21)
GPS_TX: 1_MCU (U100.8), 6_GPS (MD600.20)
IMU_INT: 1_MCU (U100.7), 4_IMU (U400.12)
SCL_IMU: 1_MCU (U100.17), 4_IMU (R401.1 U400.23)
SD_CD: 1_MCU (U100.15), 5_Sd_Card (P?.9 R500.1)
SD_CS: 1_MCU (U100.4), 5_Sd_Card (P?.2 R502.1)
SD_MISO: 1_MCU (U100.10), 5_Sd_Card (P?.7 R501.1)
SD_MOSI: 1_MCU (U100.5), 5_Sd_Card (P?.3)
SD_SCK: 1_MCU (U100.11), 5_Sd_Card (P?.5)
SDA_IMU: 1_MCU (U100.12), 4_IMU (R400.1 U400.24)
USB_D_N: 1_MCU (U101.4), 2_Power (D202.3 D202.4 J201.A7 J201.B7)
USB_D_P: 1_MCU (U101.3), 2_Power (D202.1 D202.6 J201.A6 J201.B6)
VBat: 1_MCU (U100.39), 2_Power (C200.2 R200.1 R201.2)